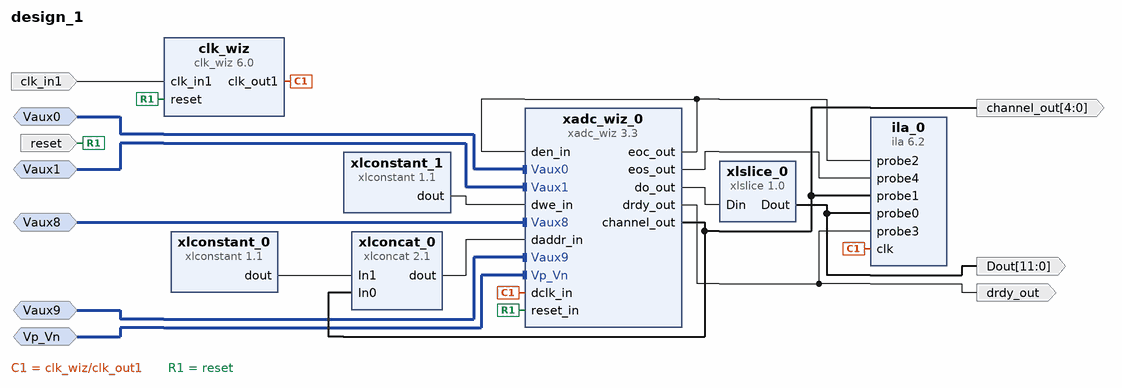
[diagram p0: block diagram of the top level]
# Vivado block design design_1, xc7z010clg400-1, Vivado 2023.2
create_bd_design design_1

create_bd_intf_port -mode Slave -vlnv xilinx.com:interface:diff_analog_io_rtl:1.0 Vp_Vn
create_bd_intf_port -mode Slave -vlnv xilinx.com:interface:diff_analog_io_rtl:1.0 Vaux0
create_bd_intf_port -mode Slave -vlnv xilinx.com:interface:diff_analog_io_rtl:1.0 Vaux1
create_bd_intf_port -mode Slave -vlnv xilinx.com:interface:diff_analog_io_rtl:1.0 Vaux8
create_bd_intf_port -mode Slave -vlnv xilinx.com:interface:diff_analog_io_rtl:1.0 Vaux9
create_bd_port -dir I -type rst reset
set_property -dict {CONFIG.POLARITY ACTIVE_HIGH} [get_bd_ports reset]
create_bd_port -dir I -type clk clk_in1
create_bd_port -dir O -from 11 -to 0 Dout
create_bd_port -dir O drdy_out
create_bd_port -dir O -from 4 -to 0 -type data channel_out

create_bd_cell -type ip -vlnv xilinx.com:ip:xadc_wiz:3.3 xadc_wiz_0
set_property -dict [list \
  CONFIG.CHANNEL_ENABLE_VAUXP0_VAUXN0 true \
  CONFIG.CHANNEL_ENABLE_VAUXP1_VAUXN1 true \
  CONFIG.CHANNEL_ENABLE_VAUXP8_VAUXN8 true \
  CONFIG.CHANNEL_ENABLE_VAUXP9_VAUXN9 true \
  CONFIG.CHANNEL_ENABLE_VP_VN true \
  CONFIG.ENABLE_RESET true \
  CONFIG.ENABLE_VCCDDRO_ALARM false \
  CONFIG.ENABLE_VCCPAUX_ALARM false \
  CONFIG.ENABLE_VCCPINT_ALARM false \
  CONFIG.EXTERNAL_MUX_CHANNEL VP_VN \
  CONFIG.INTERFACE_SELECTION ENABLE_DRP \
  CONFIG.OT_ALARM false \
  CONFIG.SEQUENCER_MODE Off \
  CONFIG.SINGLE_CHANNEL_SELECTION TEMPERATURE \
  CONFIG.STIMULUS_FREQ 1.0 \
  CONFIG.USER_TEMP_ALARM false \
  CONFIG.VCCAUX_ALARM false \
  CONFIG.VCCINT_ALARM false \
  CONFIG.WAVEFORM_TYPE SIN \
  CONFIG.XADC_STARUP_SELECTION independent_adc \
] [get_bd_cells xadc_wiz_0]
create_bd_cell -type ip -vlnv xilinx.com:ip:clk_wiz:6.0 clk_wiz
create_bd_cell -type ip -vlnv xilinx.com:ip:ila:6.2 ila_0
set_property -dict [list \
  CONFIG.ALL_PROBE_SAME_MU_CNT 2 \
  CONFIG.C_ADV_TRIGGER true \
  CONFIG.C_DATA_DEPTH 2048 \
  CONFIG.C_EN_STRG_QUAL 1 \
  CONFIG.C_MONITOR_TYPE Native \
  CONFIG.C_NUM_OF_PROBES 5 \
  CONFIG.C_PROBE0_WIDTH 12 \
  CONFIG.C_PROBE1_WIDTH 5 \
] [get_bd_cells ila_0]
create_bd_cell -type ip -vlnv xilinx.com:ip:xlslice:1.0 xlslice_0
set_property -dict {CONFIG.DIN_TO 4 CONFIG.DIN_WIDTH 16 CONFIG.DOUT_WIDTH 12} [get_bd_cells xlslice_0]
create_bd_cell -type ip -vlnv xilinx.com:ip:xlconcat:2.1 xlconcat_0
set_property -dict {CONFIG.IN0_WIDTH 5 CONFIG.IN1_WIDTH 2} [get_bd_cells xlconcat_0]
create_bd_cell -type ip -vlnv xilinx.com:ip:xlconstant:1.1 xlconstant_0
set_property -dict {CONFIG.CONST_VAL 0 CONFIG.CONST_WIDTH 2} [get_bd_cells xlconstant_0]
create_bd_cell -type ip -vlnv xilinx.com:ip:xlconstant:1.1 xlconstant_1
set_property -dict {CONFIG.CONST_VAL 0} [get_bd_cells xlconstant_1]

# ---- connections ----

connect_bd_intf_net -intf_net Vaux0_0_1 [get_bd_intf_ports Vaux0] [get_bd_intf_pins xadc_wiz_0/Vaux0]
connect_bd_intf_net -intf_net Vaux1_0_1 [get_bd_intf_ports Vaux1] [get_bd_intf_pins xadc_wiz_0/Vaux1]
connect_bd_intf_net -intf_net Vaux8_0_1 [get_bd_intf_ports Vaux8] [get_bd_intf_pins xadc_wiz_0/Vaux8]
connect_bd_intf_net -intf_net Vaux9_0_1 [get_bd_intf_ports Vaux9] [get_bd_intf_pins xadc_wiz_0/Vaux9]
connect_bd_intf_net -intf_net Vp_Vn_0_1 [get_bd_intf_ports Vp_Vn] [get_bd_intf_pins xadc_wiz_0/Vp_Vn]
connect_bd_net -net clk_in1_0_1 [get_bd_ports clk_in1] [get_bd_pins clk_wiz/clk_in1]
connect_bd_net [get_bd_pins clk_wiz/clk_out1] [get_bd_pins xadc_wiz_0/dclk_in] [get_bd_pins ila_0/clk]
connect_bd_net -net reset_0_1 [get_bd_ports reset] [get_bd_pins clk_wiz/reset] [get_bd_pins xadc_wiz_0/reset_in]
connect_bd_net [get_bd_pins xadc_wiz_0/channel_out] [get_bd_pins ila_0/probe1] [get_bd_pins xlconcat_0/In0] [get_bd_ports channel_out]
connect_bd_net [get_bd_pins xadc_wiz_0/do_out] [get_bd_pins xlslice_0/Din]
connect_bd_net [get_bd_pins xadc_wiz_0/drdy_out] [get_bd_ports drdy_out] [get_bd_pins ila_0/probe3]
connect_bd_net [get_bd_pins xadc_wiz_0/eoc_out] [get_bd_pins xadc_wiz_0/den_in] [get_bd_pins ila_0/probe2]
connect_bd_net [get_bd_pins xadc_wiz_0/eos_out] [get_bd_pins ila_0/probe4]
connect_bd_net [get_bd_pins xlconcat_0/dout] [get_bd_pins xadc_wiz_0/daddr_in]
connect_bd_net [get_bd_pins xlconstant_0/dout] [get_bd_pins xlconcat_0/In1]
connect_bd_net [get_bd_pins xlconstant_1/dout] [get_bd_pins xadc_wiz_0/dwe_in]
connect_bd_net [get_bd_pins xlslice_0/Dout] [get_bd_ports Dout] [get_bd_pins ila_0/probe0]

validate_bd_design
save_bd_design
